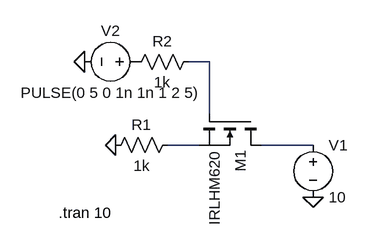
[diagram p0: schematic common drain.asc]
common drain.asc, the LTspice schematic file:
Version 4.1
SHEET 1 880 680
WIRE 160 48 128 48
WIRE 160 128 160 48
WIRE 144 176 96 176
WIRE 320 176 240 176
FLAG 320 256 0
FLAG -32 48 0
FLAG 16 176 0
SYMBOL nmos 240 128 R90
SYMATTR InstName M1
SYMATTR Value IRLHM620
SYMBOL voltage 320 160 R0
WINDOW 123 0 0 Left 0
WINDOW 39 0 0 Left 0
SYMATTR InstName V1
SYMATTR Value 10
SYMBOL voltage 64 48 R90
WINDOW 0 -32 56 VBottom 2
WINDOW 3 32 56 VTop 2
WINDOW 123 0 0 Left 0
WINDOW 39 0 0 Left 0
SYMATTR InstName V2
SYMATTR Value PULSE(0 5 0 1n 1n 1 2 5)
SYMBOL res 112 160 R90
WINDOW 0 0 56 VBottom 2
WINDOW 3 32 56 VTop 2
SYMATTR InstName R1
SYMATTR Value 1k
SYMBOL res 144 32 R90
WINDOW 0 0 56 VBottom 2
WINDOW 3 32 56 VTop 2
SYMATTR InstName R2
SYMATTR Value 1k
TEXT -72 280 Left 2 !.tran 10

The netlist it stands for:
* common drain.asc
M1 N003 N001 N002 N002 IRLHM620
V1 N003 0 10
V2 P001 0 PULSE(0 5 0 1n 1n 1 2 5)
R1 N002 0 1k
R2 N001 P001 1k
.model NMOS NMOS
.model PMOS PMOS
.lib standard.mos
.tran 10
.backanno
.end